# EAGLE design smart-bike-light (EAGLE 7.3.0)
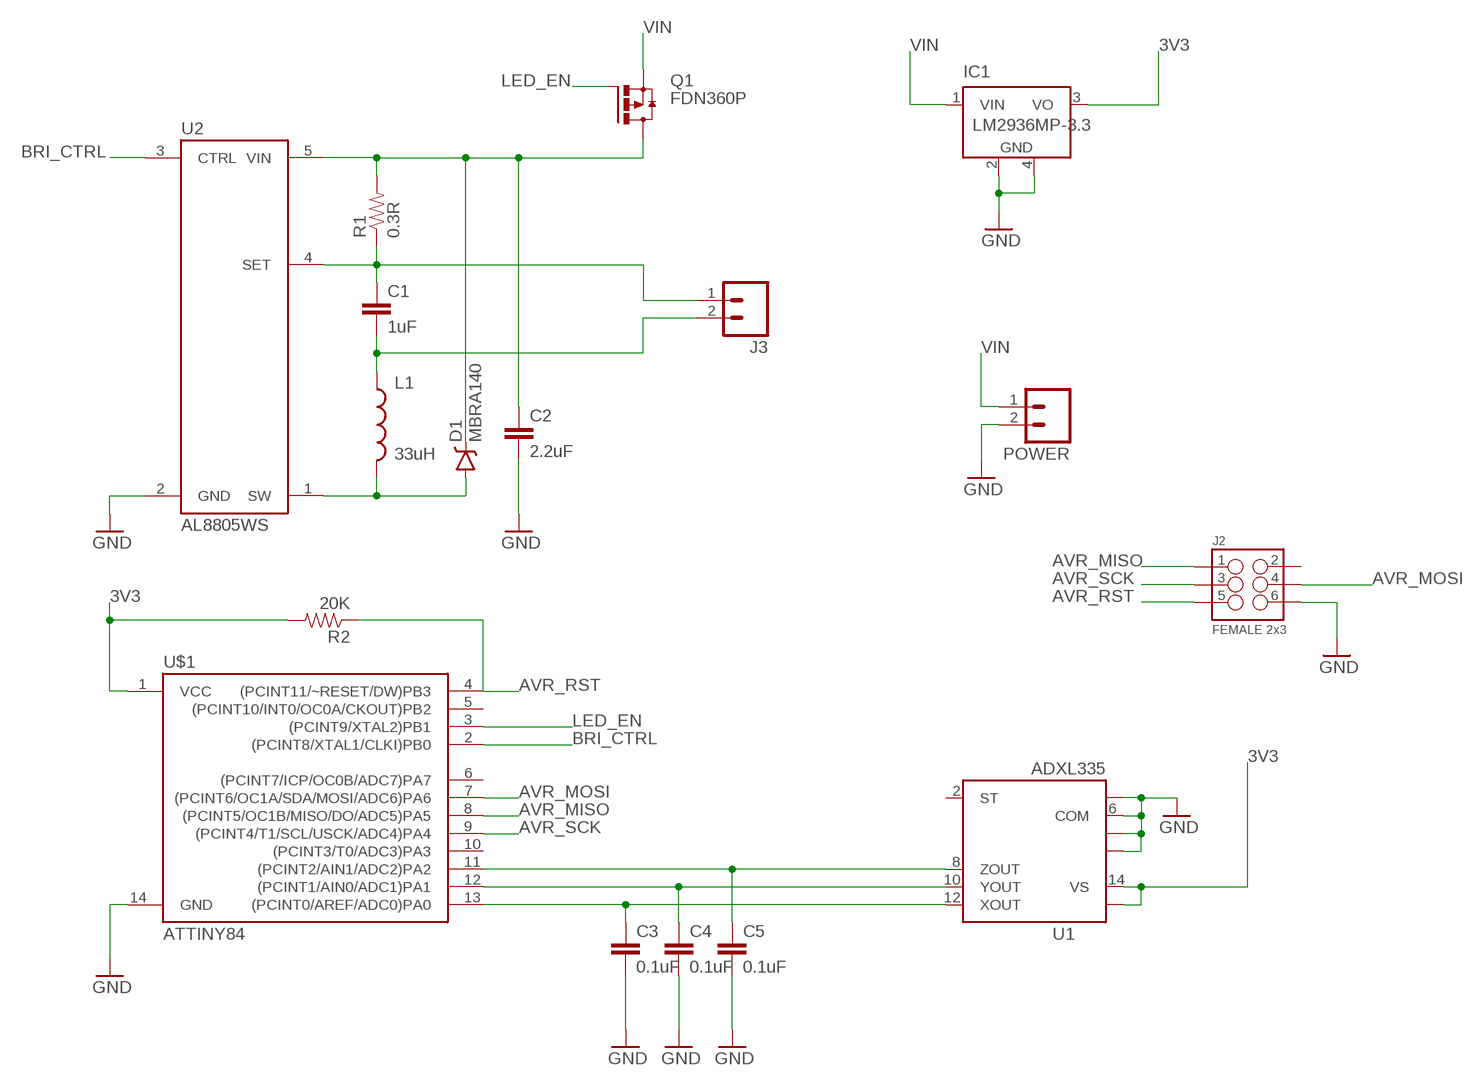
[diagram p0: schematic, sheet 1]

## Parts
C1  1uF  CAP0603-CAP  [0603-CAP]
C2  2.2uF  CAP0603-CAP  [0603-CAP]
C3  0.1uF  0.1UF-25V-5%(0603)  [0603-CAP]
C4  0.1uF  0.1UF-25V-5%(0603)  [0603-CAP]
C5  0.1uF  0.1UF-25V-5%(0603)  [0603-CAP]
D1  MBRA140  [SMA-DIODE]
IC1  LM2936MP-3.3  [SOT223]
J2  FEMALE 2x3  M03X2FEMALE  [2X3]
J3  M02PTH  [1X02]
L1  33uH  INDUCTORBOURNS_SRN6045  [SRN6045]
POWER  M02PTH  [1X02]
Q1  FDN360P  [SUPER-SOT3]
R1  0.3R  RESISTOR0603  [0603-RES]
R2  20K  RESISTOR0603  [0603-RES]
U1  ADXL335  [LFCSP-16]
U2  AL8805WS  AL8805  [SOT23-5]
U$1  ATTINY84  [SO14]

## Nets
3V3: IC1.3(VO) R2.2 U1.14(VS) U1.15(VS) U$1.1(VCC)
AVR_MISO: J2.1 U$1.8((PCINT5/OC1B/MISO/DO/ADC5)PA5)
AVR_MOSI: J2.4 U$1.7((PCINT6/OC1A/SDA/MOSI/ADC6)PA6)
AVR_RST: J2.5 R2.1 U$1.4((PCINT11/~RESET/DW)PB3)
AVR_SCK: J2.3 U$1.9((PCINT4/T1/SCL/USCK/ADC4)PA4)
BRI_CTRL: U2.3(CTRL) U$1.2((PCINT8/XTAL1/CLKI)PB0)
GND: C2.2 C3.2 C4.2 C5.2 IC1.2(GND) IC1.4(GND) J2.6 POWER.2 U1.3(COM) U1.5(COM) U1.6(COM) U1.7(COM) U2.2(GND) U$1.14(GND)
LED_EN: Q1.1(G) U$1.3((PCINT9/XTAL2)PB1)
N$1: C1.1 J3.1 R1.1 U2.4(SET)
N$2: C2.1 D1.C Q1.3(D) R1.2 U2.5(VIN)
N$3: D1.A L1.2 U2.1(SW)
N$4: C1.2 J3.2 L1.1
N$5: C3.1 U1.12(XOUT) U$1.13((PCINT0/AREF/ADC0)PA0)
N$6: C4.1 U1.10(YOUT) U$1.12((PCINT1/AIN0/ADC1)PA1)
N$7: C5.1 U1.8(ZOUT) U$1.11((PCINT2/AIN1/ADC2)PA2)
VIN: IC1.1(VIN) POWER.1 Q1.2(S)
Unconnected: J2.2 U1.2(ST) U$1.5((PCINT10/INT0/OC0A/CKOUT)PB2) U$1.6((PCINT7/ICP/OC0B/ADC7)PA7) U$1.10((PCINT3/T0/ADC3)PA3)

## Library data of the parts
C1 C2 = SparkFun-Capacitors:CAP: Capacitor Standard 0603 ceramic capacitor, and 0.1" leaded capacitor.
C3-C5 = SparkFun-Capacitors:0.1UF-25V-5%(0603): CAP-08604; PROD_ID: CAP-08604
D1 = SparkFun-DiscreteSemi:MBRA140: 40V, 1A Schottky rectifier SMA/DO-214AC package DIO-08053; PROD_ID: DIO-08053
IC1 = national-semiconductor:LM2936MP?*: Ultra-Low Quiescent Current LDO Voltage Regulator Source: Data sheet <http://www.national.com/ds/LM/LM2936.pdf>; MF: NATIONAL SEMICONDUCTOR; MPN: LM2936MP-3.3/NOPB; OC_FARNELL: 1469062; OC_NEWARK: 41K4523
J2 = SparkFun-Connectors:M03X2: 2x3 .1" header. Shrouded, with keying- CONN-10681 SMT- CONN-11415 Pogo pins- HW-11044; PROD_ID: CONN-11566
J3 POWER = SparkFun-Connectors:M02: Standard 2-pin 0.1" header. Use with - straight break away headers ( PRT-00116) - right angle break away headers (PRT-00553) - swiss pins (PRT-00743) - machine pins (PRT-00117) - female headers (PRT-00115) Molex polarized connector foot print use with: PRT-08233 with associated crimp pins and housings. 2.54_SCREWTERM for use with PRT-10571. 3.5mm Screw Terminal footprints for PRT-08084 5mm Screw Terminal footprints for use with PRT-08432
L1 = SparkFun-Passives:INDUCTOR: Inductors Basic Inductor/Choke - 0603 and 1206. Footprints are not proven and vary greatly between part numbers. INDUCTOR POWER 3.3UH 4.0A SMD 0.197" L x 0.197" W x 0.177" H (5.00mm x 5.00mm x 4.50mm); PROD_ID: NDUC-11627
Q1 = transistor-power:FDN360P: Single P-Channel, PowerTrench (R) MOSFET Source: http://www.fairchildsemi.com/ds/FD/FDN360P.pdf
R1 R2 = SparkFun-Resistors:RESISTOR: Resistor Basic schematic elements and footprints for 0603, 1206, and PTH resistors.
U1 = SparkFun-Sensors:ADXL335: 3-axis, 3g accelerometer, analog out
U2 = SparkFun-PowerIC:AL8805: Constant current LED driver PWM-able 1MHz switch freq 6V-36V Up to 1A LED current; PROD_ID: IC-11626
U$1 = SparkFun-DigitalIC:ATTINY84: Atmel 14-pin 2/4/8kB flash uC; PROD_ID: IC-11285

## Board
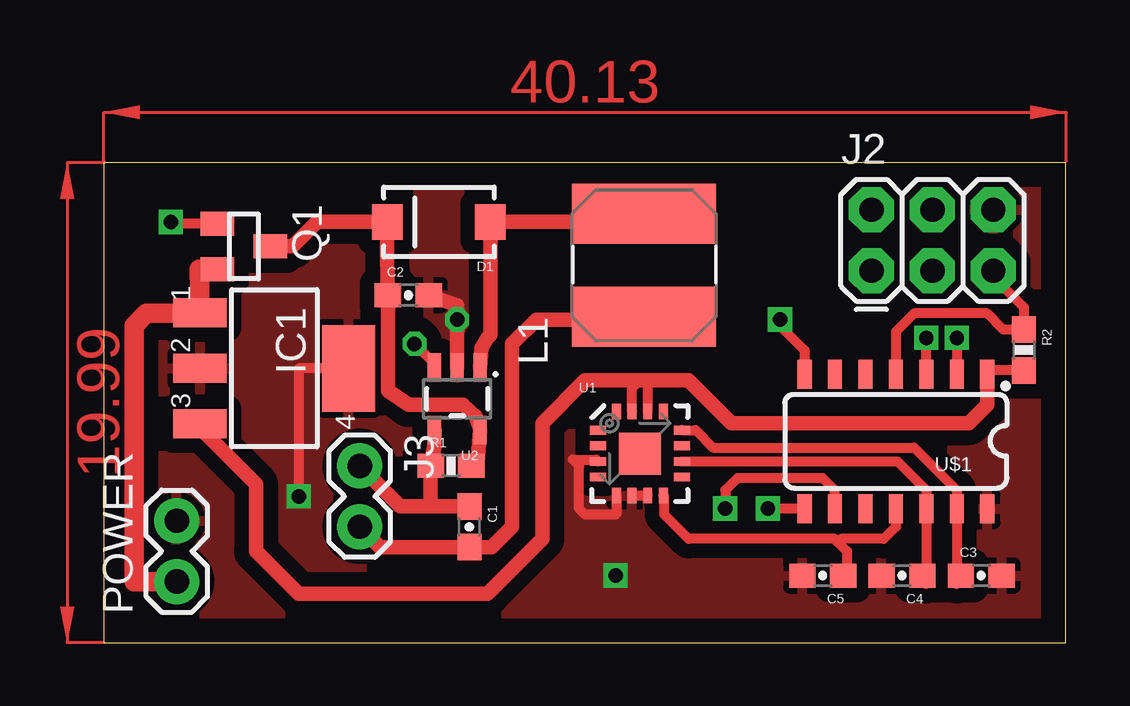
[diagram p1: board, top side]
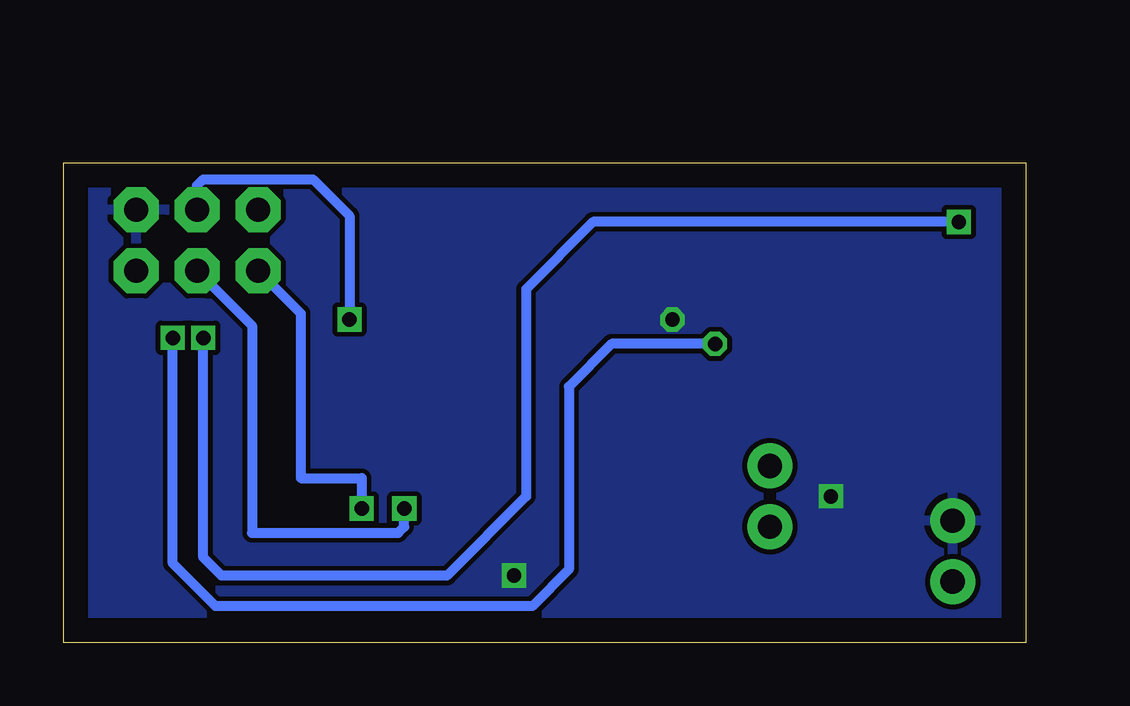
[diagram p2: board, bottom side, seen from below]

Size 40.11 x 19.99 mm. Coordinates in mm from the lower left corner, seen from the top.
Outline: 0,0 40.11,0 40.11,19.99 0,19.99 0,0
Copper layers (1*16): Top 0.035mm / dielectric 1.5mm / Bottom 0.035mm
Design rules "default": minimum track width 10mil, minimum drill 24mil, track to track 8mil, track to pad 8mil, pad to pad 8mil, via to via 8mil, smd to smd 8mil, copper to edge 40mil, drill to drill 8mil, minimum pad ring 10mil, minimum via ring 8mil, stop-mask expansion 4mil, vias tented up to drill 0mil, thermal gap 10mil

### Footprints (pad centres in the part's own frame; a part is rotated, then mirrored left to right if it is on the bottom)
0603-CAP = smd 1.1 x 1: 1 -0.85,0; 2 0.85,0
SMA-DIODE = smd 1.27 x 1.47: A -2.15,0; C 2.15,0
SOT223 = smd 1.219 x 2.235: 1 -2.311,-3.099; 2 0,-3.099; 3 2.311,-3.099 | smd 3.6 x 2.2: 4 0,3.099
2X3 = drill 1.016 pad 1.88 octagon: 1 0,0; 2 0,2.54; 3 2.54,0; 4 2.54,2.54; 5 5.08,0; 6 5.08,2.54
1X02 = drill 1.016 pad 1.88: 1 0,0; 2 2.54,0
SRN6045 = smd 2.5 x 6: 1 -2.175,-0.175; 2 2.125,-0.175
SUPER-SOT3 = smd 1 x 1.4: 1 -0.95,-1.1; 2 0.95,-1.1; 3 0,1.1
0603-RES = smd 1.1 x 1: 1 -0.85,0; 2 0.85,0
LFCSP-16 = smd 1.75 x 1.75: 0 0,0 | smd 0.65 x 0.37: 1 -1.75,0.975; 2 -1.75,0.325; 3 -1.75,-0.325; 4 -1.75,-0.975; 9 1.75,-0.975; 10 1.75,-0.325; 11 1.75,0.325; 12 1.75,0.975 | smd 0.37 x 0.65: 5 -0.975,-1.75; 6 -0.325,-1.75; 7 0.325,-1.75; 8 0.975,-1.75; 13 0.975,1.75; 14 0.325,1.75; 15 -0.325,1.75; 16 -0.975,1.75
SOT23-5 = smd 0.55 x 1.2: 1 -0.95,-1.3; 2 0,-1.3; 3 0.95,-1.3; 4 0.95,1.3; 5 -0.95,1.3
SO14 = smd 0.6 x 1.2: 1 -3.81,-2.8; 2 -2.54,-2.8; 3 -1.27,-2.8; 4 0,-2.8; 5 1.27,-2.8; 6 2.54,-2.8; 7 3.81,-2.8; 8 3.81,2.8; 9 2.54,2.8; 10 1.27,2.8; 11 0,2.8; 12 -1.27,2.8; 13 -2.54,2.8; 14 -3.81,2.8

### Placement (x,y rotation side)
C1  15.24,4.83 270 top
C2  12.7,14.48 0 top
C3  36.58,2.79 0 top
C4  33.27,2.79 180 top
C5  29.97,2.79 180 top
D1  13.97,17.53 180 top
IC1  7.11,11.43 270 top
J2  32,15.49 0 top
J3  10.67,7.37 270 top
L1  22.35,15.75 90 top
POWER  3.05,2.54 90 top
Q1  5.84,16.51 270 top
R1  14.48,7.37 0 top
R2  38.35,12.19 270 top
U1  22.35,7.87 0 top
U2  14.73,10.16 180 top
U$1  33.02,8.38 180 top

### Tracks (layer width: path | path; a pad name or v marks a point on that pad's centre or on a via)
3V3
  Top 0.406: R2.2 36.99,11.34 U$1.1 | U1.15 22.03,10.6 22.35,10.92 | U1.14 22.68,10.85 22.61,10.92
  Top 0.61: IC1.3 3.83,9.12 6.35,6.6 6.35,3.81 8.13,2.03 16,2.03 18.29,4.32 18.29,9.14 20.07,10.92 22.35,10.92 22.61,10.92 24.38,10.92 26.16,9.14 36.07,9.14 36.83,9.91 U$1.1
AVR_MISO  (via drill 0.6)
  Top 0.406: U$1.8 v27.69,5.58 v27.69,5.59
  Bottom 0.406: J2.1 30.23,13.72 30.23,6.86 27.69,6.86 v27.69,5.59
AVR_MOSI  (via drill 0.6)
  Top 0.406: v28.19,13.46 28.19,13.21 29.21,12.19 U$1.7
  Bottom 0.406: J2.4 34.54,19.05 34.29,19.3 29.72,19.3 28.19,17.78 v28.19,13.46
AVR_RST
  Top 0.406: J2.5 37.08,15.24 38.35,13.97 R2.1 37.5,13.04 36.83,13.72 33.78,13.72 33.02,12.95 U$1.4
AVR_SCK  (via drill 0.6)
  Top 0.406: U$1.9 30.48,6.35 29.97,6.86 26.42,6.86 25.91,6.35 v25.91,5.59
  Bottom 0.406: J2.3 32.26,13.21 32.26,4.57 26.16,4.57 25.91,4.83 v25.91,5.59
BRI_CTRL  (via drill 0.6)
  Top 0.406: U2.3 13.78,11.62 v12.95,12.45 | v35.56,12.7 U$1.2
  Bottom 0.406: v12.95,12.45 17.27,12.45 19.05,10.67 19.05,3.05 20.57,1.52 33.78,1.52 35.56,3.3 v35.56,12.7
GND  (via drill 0.6)
  Top 0.406: U1.7 U1.6 | 21.38,2.83 v21.34,2.79 | IC1.4 8.13,11.43 v8.13,6.1 | U1.5 21.38,5.38 21.34,5.33 20.07,5.33 19.81,5.59 19.81,7.37 19.56,7.62 20.53,7.62 U1.3
  Top 0.61: U2.2 14.73,14.06 C2.2
  other vias: 14.73,13.46
  pour Top (isolate 0.61): 0,20.07 0,0 40.13,0 40.13,20.07
  pour Bottom: 0,0 0,20.07 40.13,20.07 40.13,19.81 40.13,0
LED_EN  (via drill 0.6)
  Top 0.406: U$1.3 v34.29,12.7 | Q1.1 2.86,17.46 v2.79,17.53
  Bottom 0.406: v2.79,17.53 18.03,17.53 20.83,14.73 20.83,6.1 24.13,2.79 33.53,2.79 34.29,3.56 v34.29,12.7
N$1
  Top 0.61: U2.4 13.78,8.23 R1.1 13.63,5.76 13.72,5.68 | C1.1 13.72,5.68 | 13.72,5.68 12.36,5.68 J3.1
N$2
  Top 0.61: Q1.3 7.87,16.51 8.89,17.53 D1.C 11.82,16.03 C2.1 11.85,10.5 12.7,9.91 14.99,9.91 15.49,9.43 U2.5 15.58,7.49 R1.2
N$3
  Top 0.61: L1.2 20.4,17.27 20.32,17.53 D1.A 16.12,12.82 16,12.7 15.75,12.29 U2.1
N$4
  Top 0.61: J3.2 11.52,3.98 C1.2 16.17,3.98 17.02,4.83 17.02,12.45 18.03,13.46 20.61,13.46 L1.1
N$5
  Top 0.406: C3.1 35.56,2.45 U$1.13 35.56,6.35 33.78,8.13 25.4,8.13 24.68,8.85 U1.12
N$6
  Top 0.406: C4.1 34.29,2.45 U$1.12 34.29,6.35 33.09,7.55 U1.10
N$7
  Top 0.406: U1.8 23.37,6.08 23.37,5.33 24.38,4.32 30.48,4.32 30.61,4.19 | 30.61,4.19 30.99,3.81 30.99,2.96 C5.1 | U$1.11 33.02,4.83 32.51,4.32 30.73,4.32 30.61,4.19
VIN
  Top 0.813: POWER.1 1.27,2.54 1.27,13.21 1.78,13.72 2.97,13.72 IC1.1 3.98,15.55 Q1.2
(copper drawn outside any net)
  shapes: Top area x2